# EAGLE schematic regulator-SPX3819M5-L (EAGLE 9.5.2)
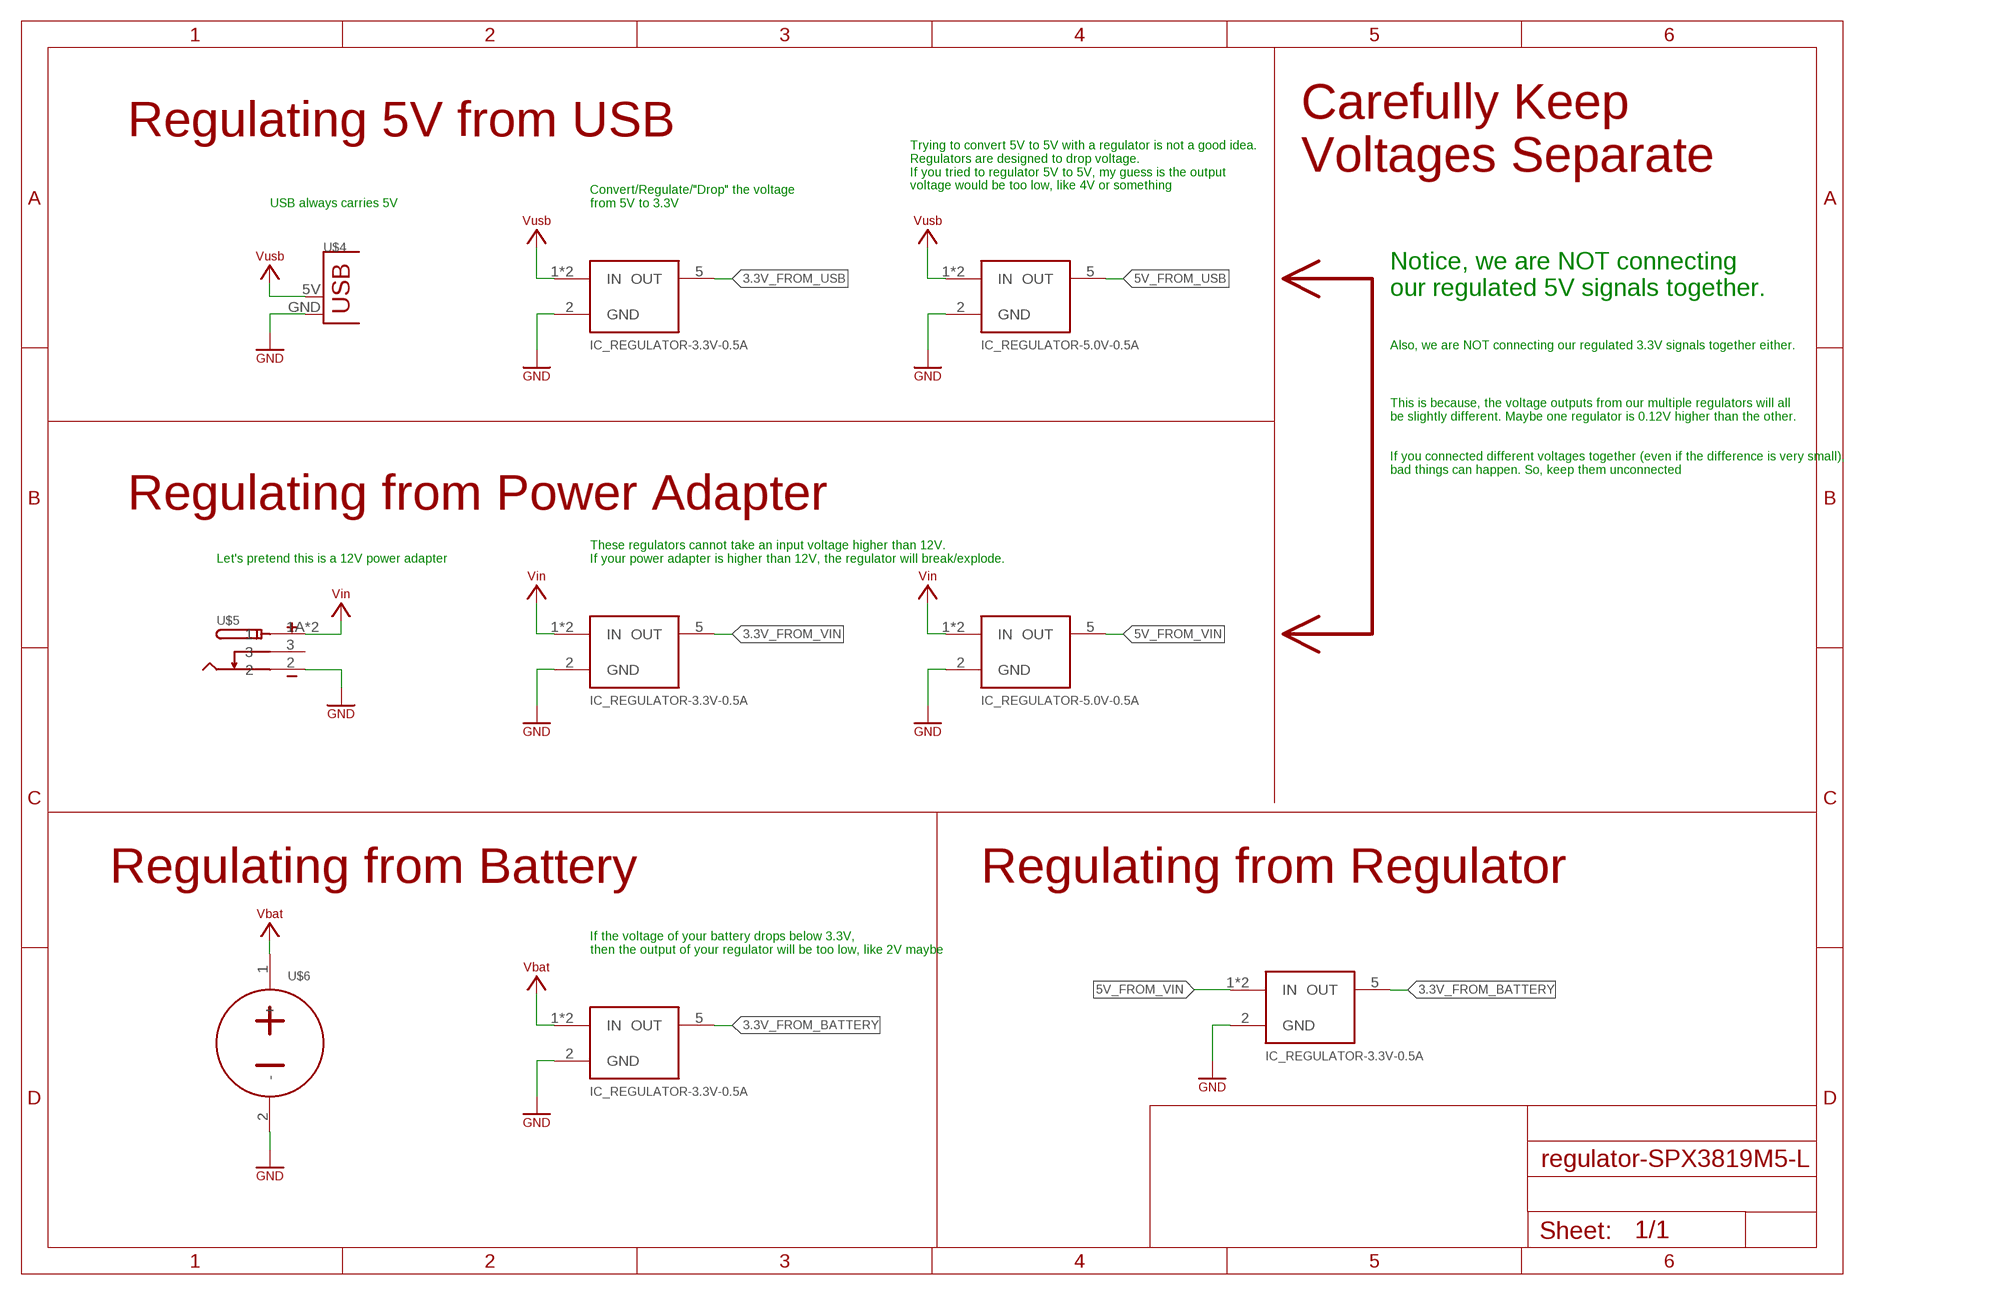
[diagram p0: schematic, sheet 1]

## Parts
U$1  IC_REGULATOR-3.3V-0.5A  [SOT23-5]
U$4  CONN_USB_PCB_POWER  [USB-PCB-POWER]
U$5  CONN_DC_BARREL-SMD  [694106106102]
U$6  CONN_BATTERY-LIPO-HORIZ  [JST-PH-2-SMT-RA]
U$9  IC_REGULATOR-3.3V-0.5A  [SOT23-5]
U$11  IC_REGULATOR-3.3V-0.5A  [SOT23-5]
U$15  IC_REGULATOR-3.3V-0.5A  [SOT23-5]
U$18  IC_REGULATOR-5.0V-0.5A  [SOT23-5]
U$19  IC_REGULATOR-5.0V-0.5A  [SOT23-5]

## Nets
3.3V_FROM_BATTERY: U$9.5(OUT) U$15.5(OUT)
3.3V_FROM_USB: U$11.5(OUT)
3.3V_FROM_VIN: U$1.5(OUT)
5V_FROM_USB: U$19.5(OUT)
5V_FROM_VIN: U$15.1(IN) U$15.3(IN) U$18.5(OUT)
GND: U$1.2(GND) U$4.GND U$5.2 U$6.2(-) U$9.2(GND) U$11.2(GND) U$15.2(GND) U$18.2(GND) U$19.2(GND) ; supply symbol labelled SYMBOL_GND
VBAT: U$6.1(+) U$9.1(IN) U$9.3(IN) ; supply symbol labelled SYMBOL_VBAT
VIN: U$1.1(IN) U$1.3(IN) U$5.1A U$5.1B U$18.1(IN) U$18.3(IN) ; supply symbol labelled SYMBOL_VIN
VUSB: U$4.5V(VBUS) U$11.1(IN) U$11.3(IN) U$19.1(IN) U$19.3(IN) ; supply symbol labelled SYMBOL_VUSB
Unconnected: U$5.3

## Notes on the sheet
- Regulating 5V from USB
- Carefully Keep
  Voltages Separate
- Trying to convert 5V to 5V with a regulator is not a good idea.
  Regulators are designed to drop voltage.
  If you tried to regulator 5V to 5V, my guess is the output
  voltage would be too low, like 4V or something
- USB always carries 5V
- Convert/Regulate/"Drop" the voltage
  from 5V to 3.3V
- Notice, we are NOT connecting
  our regulated 5V signals together.
- Also, we are NOT connecting our regulated 3.3V signals together either.
- This is because, the voltage outputs from our multiple regulators will all
  be slightly different. Maybe one regulator is 0.12V higher than the other.
- If you connected different voltages together (even if the difference is very small),
  bad things can happen. So, keep them unconnected
- Regulating from Power Adapter
- Let's pretend this is a 12V power adapter
- These regulators cannot take an input voltage higher than 12V.
  If your power adapter is higher than 12V, the regulator will break/explode.
- Regulating from Battery | Regulating from Regulator
- If the voltage of your battery drops below 3.3V,
  then the output of your regulator will be too low, like 2V maybe

## Library data of the parts
U$1 U$9 U$11 U$15 = homemade-hardware:IC_REGULATOR: SPX3819M5-L-5-0/TR <https://www.digikey.com/product-detail/en/maxlinear-inc/SPX3819M5-L-5-0-TR/1016-1874-6-ND/3586704>: 5.0V/0.5A SMD Linear Regulator SPX3819M5-L-3-3/TR <https://www.digikey.com/product-detail/en/maxlinear-inc/SPX3819M5-L-3-3-TR/1016-1873-6-ND/3586703>: 3.3V/0.5A SMD Linear Regulator; PN: SPX3819M5-L-3-3/TR
U$4 = homemade-hardware:CONN_USB_PCB_POWER
U$5 = homemade-hardware:CONN_DC_BARREL: 694106106102 <https://www.digikey.com/products/en/connectors-interconnects/barrel-power-connectors/435?k=694106106102&k=&pkeyword=694106106102&sv=0&pv7=2&sf=0&quantity=&ColumnSort=0&page=1&pageSize=25>: SMD DC Barrel (OD=5.5mm, ID=2mm)
U$6 = homemade-hardware:CONN_BATTERY
U$18 U$19 = homemade-hardware:IC_REGULATOR: SPX3819M5-L-5-0/TR <https://www.digikey.com/product-detail/en/maxlinear-inc/SPX3819M5-L-5-0-TR/1016-1874-6-ND/3586704>: 5.0V/0.5A SMD Linear Regulator SPX3819M5-L-3-3/TR <https://www.digikey.com/product-detail/en/maxlinear-inc/SPX3819M5-L-3-3-TR/1016-1873-6-ND/3586703>: 3.3V/0.5A SMD Linear Regulator; PN: SPX3819M5-L-5-0/TR